# EAGLE schematic openstepper (EAGLE 7.1.0)
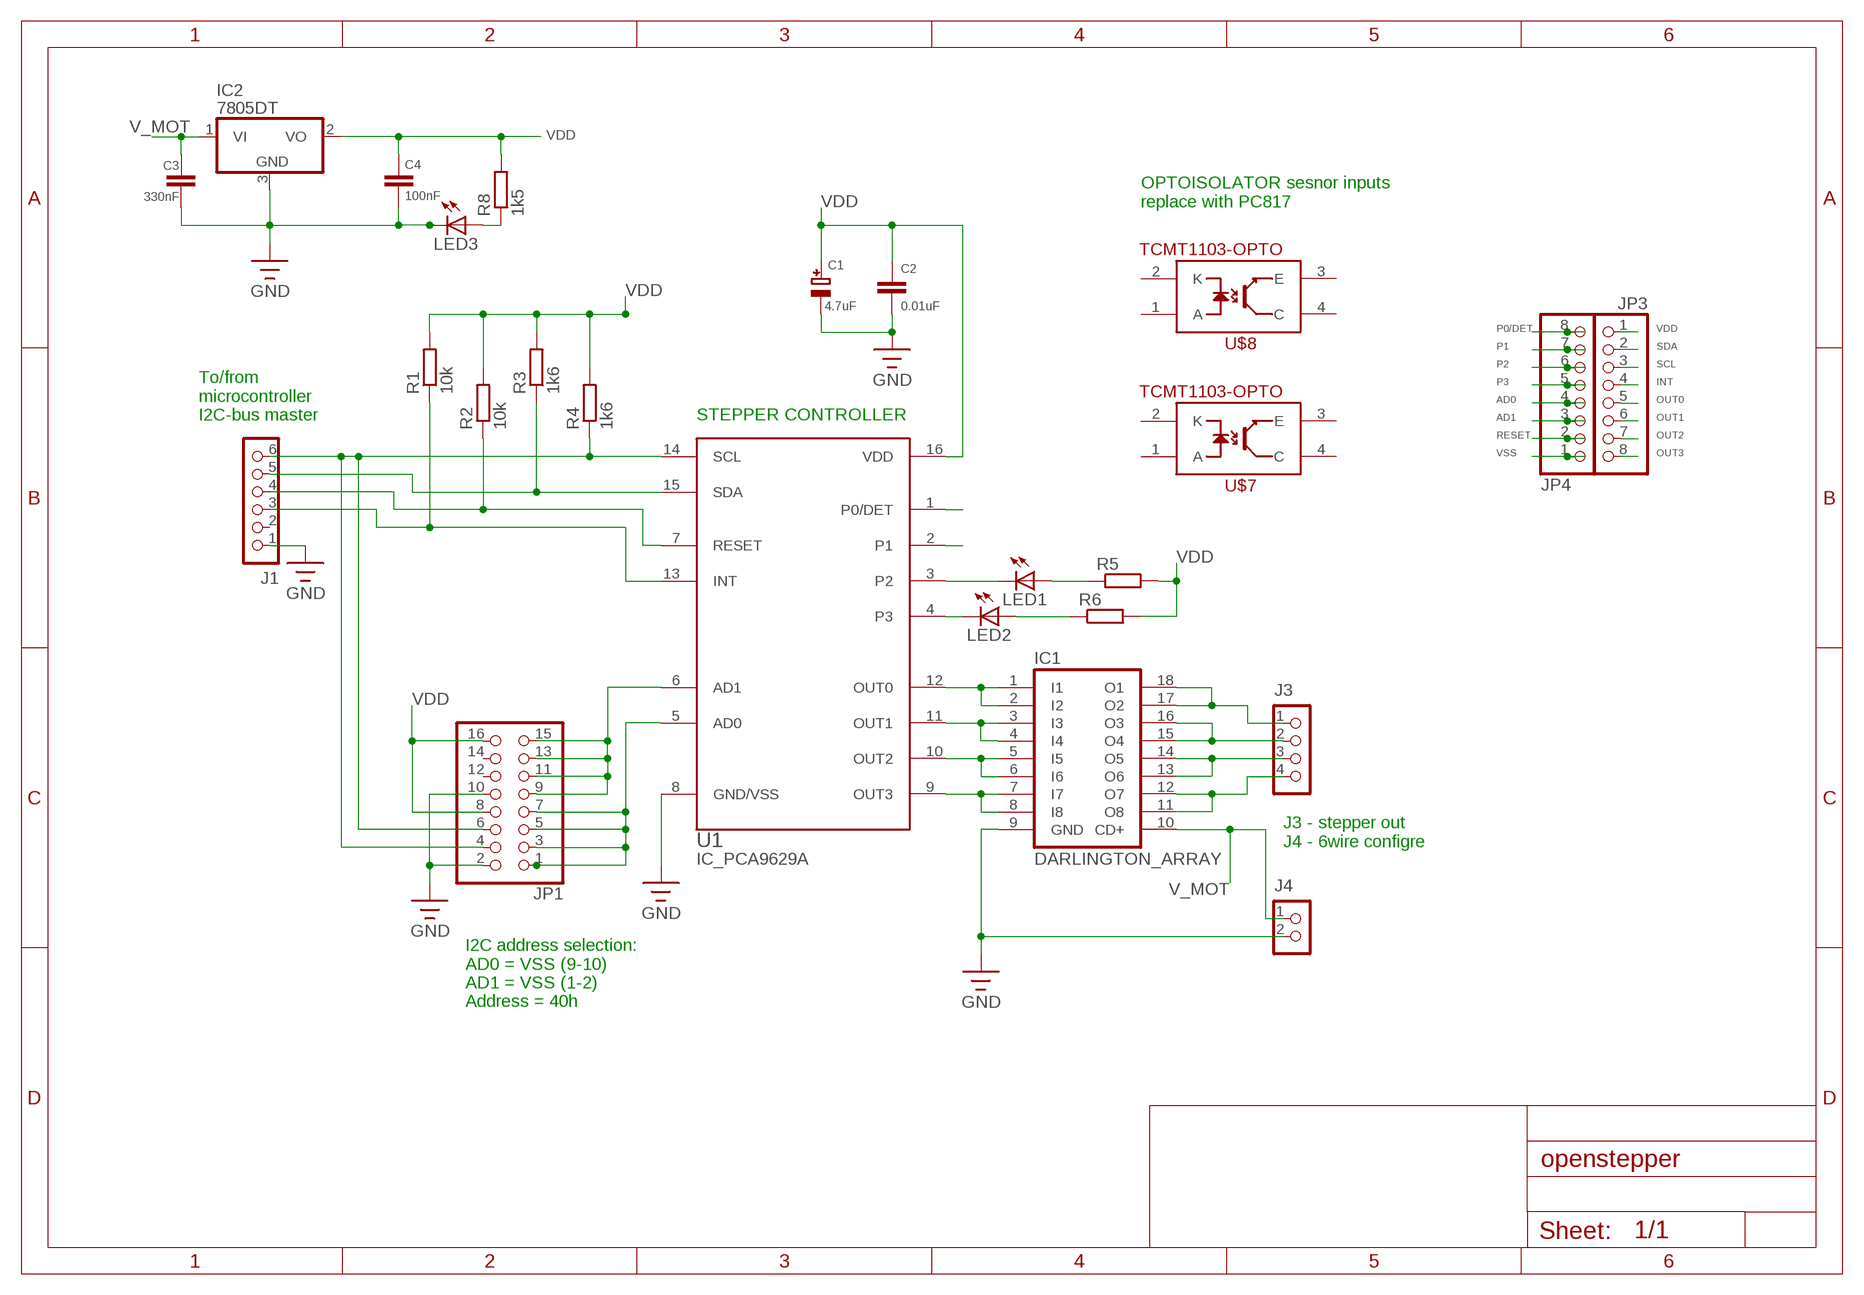
[diagram p0: schematic, sheet 1]

## Parts
C1  4.7uF  CAP_ELECTROLYTICPANASONIC_C  [PANASONIC_C]
C2  0.01uF  CAPACITOR_NPOL-0805  [C805]
C3  330nF  C-EU025-024X044  [C025-024X044]
C4  100nF  C-EU025-024X044  [C025-024X044]
IC1  DARLINGTON_ARRAY  IC_ULN2803A-SO-18  [SO-18]
IC2  7805DT  [TO252]
J1  CON_HEADER_1X06-PTH  [M1X6]
J3  CON_HEADER_1X04  [M1X4]
J4  CON_HEADER_1X02-PTH  [M1X2]
JP1  HEADER-2X8  [2X08]
JP3  PINHD-1X8BIG  [1X08-BIG]
JP4  PINHD-1X8BIG  [1X08-BIG]
LED1  LED-0805  [LED-805]
LED2  LED-0805  [LED-805]
LED3  LED-0805  [LED-805]
R1  10k  RESISTOR-1206  [R1206]
R2  10k  RESISTOR-1206  [R1206]
R3  1k6  RESISTOR-1206  [R1206]
R4  1k6  RESISTOR-1206  [R1206]
R5  RESISTORR805-0805  [R805]
R6  RESISTORR805-0805  [R805]
R8  1k5  RESISTOR-1206  [R1206]
U1  IC_PCA9629A  [TSSOP-16]
U$7  TCMT1103-OPTO  [SSOP-4]
U$8  TCMT1103-OPTO  [SSOP-4]

## Nets
AD0: JP1.1 JP1.3 JP1.5 JP1.7 JP4.4 U1.5(AD0)
AD1: JP1.9 JP1.11 JP1.13 JP1.15 JP4.3 U1.6(AD1)
GND: C1.- C2.2 C3.1 C4.1 IC1.9(GND) IC2.3(GND) J1.1 J4.2 JP1.2 JP1.10 LED3.C U1.8(GND/VSS)
INT: J1.3 JP3.4 R1.1 U1.13(INT)
N$1: LED3.A R8.1
N$6: IC1.17(O2) IC1.18(O1) J3.1
N$8: IC1.15(O4) IC1.16(O3) J3.2
N$9: IC1.13(O6) IC1.14(O5) J3.3
N$10: IC1.11(O8) IC1.12(O7) J3.4
N$11: LED1.A R5.1
N$15: LED2.A R6.1
OUT0: IC1.1(I1) IC1.2(I2) JP3.5 U1.12(OUT0)
OUT1: IC1.3(I3) IC1.4(I4) JP3.6 U1.11(OUT1)
OUT2: IC1.5(I5) IC1.6(I6) JP3.7 U1.10(OUT2)
OUT3: IC1.7(I7) IC1.8(I8) JP3.8 U1.9(OUT3)
P0/DET: JP4.8 U1.1(P0/DET)
P1: JP4.7 U1.2(P1)
P2: JP4.6 LED1.C U1.3(P2)
P3: JP4.5 LED2.C U1.4(P3)
RESET: J1.4 JP4.2 R2.1 U1.7(RESET)
SCL: J1.6 JP1.4 JP1.6 JP3.3 R4.1 U1.14(SCL)
SDA: J1.5 JP3.2 R3.1 U1.15(SDA)
V_MOT: C3.2 IC1.10(CD+) IC2.1(VI) J4.1
VDD: C1.+ C2.1 C4.2 IC2.2(VO) JP1.8 JP1.16 JP3.1 R1.2 R2.2 R3.2 R4.2 R5.2 R6.2 R8.2 U1.16(VDD)
VSS: JP4.1
Unconnected: J1.2 JP1.12 JP1.14 U$7.1(A) U$7.2(K) U$7.3(E) U$7.4(C) U$8.1(A) U$8.2(K) U$8.3(E) U$8.4(C)

## Notes on the sheet
- OPTOISOLATOR sesnor inputs
  replace with PC817
- To/from
  microcontroller
  I2C-bus master
- STEPPER CONTROLLER
- J3 - stepper out 
  J4 - 6wire configre
- I2C address selection:
  AD0 = VSS (9-10)
  AD1 = VSS (1-2)
  Address = 40h

## Library data of the parts
C1 = microbuilder:CAP_ELECTROLYTIC: Electrolytic Capacitors SMT PANASONIC_C - Size C Panasonic Electrolytic Aluminum Capacitor 47µF 16V 20% Electrolytic Capacitor [Digikey: PCE3890TR-ND] PANASONIC_D - Size D Panasonic Electrolytic Aluminum Capacitor 100µF 25V 20% Electrolytic Capacitor [Digikey: PCE3898TR-ND] PTH 3.5 mm grid, 8 mm diameter ... 3.5 mm grid, 10 mm diameter ...
C2 = dp_devices:CAPACITOR_NPOL: Non-Polarized capacitor in various packages
C3 C4 = rcl:C-EU: CAPACITOR, European symbol
IC1 = openstepper:IC_ULN2803A: DRIVER ARRAY
IC2 = adafruit:78*: Positive VOLTAGE REGULATOR Added bigger pads to the TO-92 package
J1 = dp_devices:CON_HEADER_1X06
J3 = dp_devices:CON_HEADER_1X04
J4 = dp_devices:CON_HEADER_1X02
JP1 = microbuilder:HEADER-2X8
JP3 JP4 = adafruit:PINHD-1X8: PIN HEADER
LED1-LED3 = dp_devices:LED: Light Emitting Diode
R1-R6 R8 = dp_devices:RESISTOR
U1 = openstepper:IC_PCA9629A
U$7 U$8 = SparkFun-DiscreteSemi:TCMT1103-OPTO: Optoisolator- NPN output